# EAGLE design Qwiic GPS - Titan X1 (EAGLE 7.7.0)
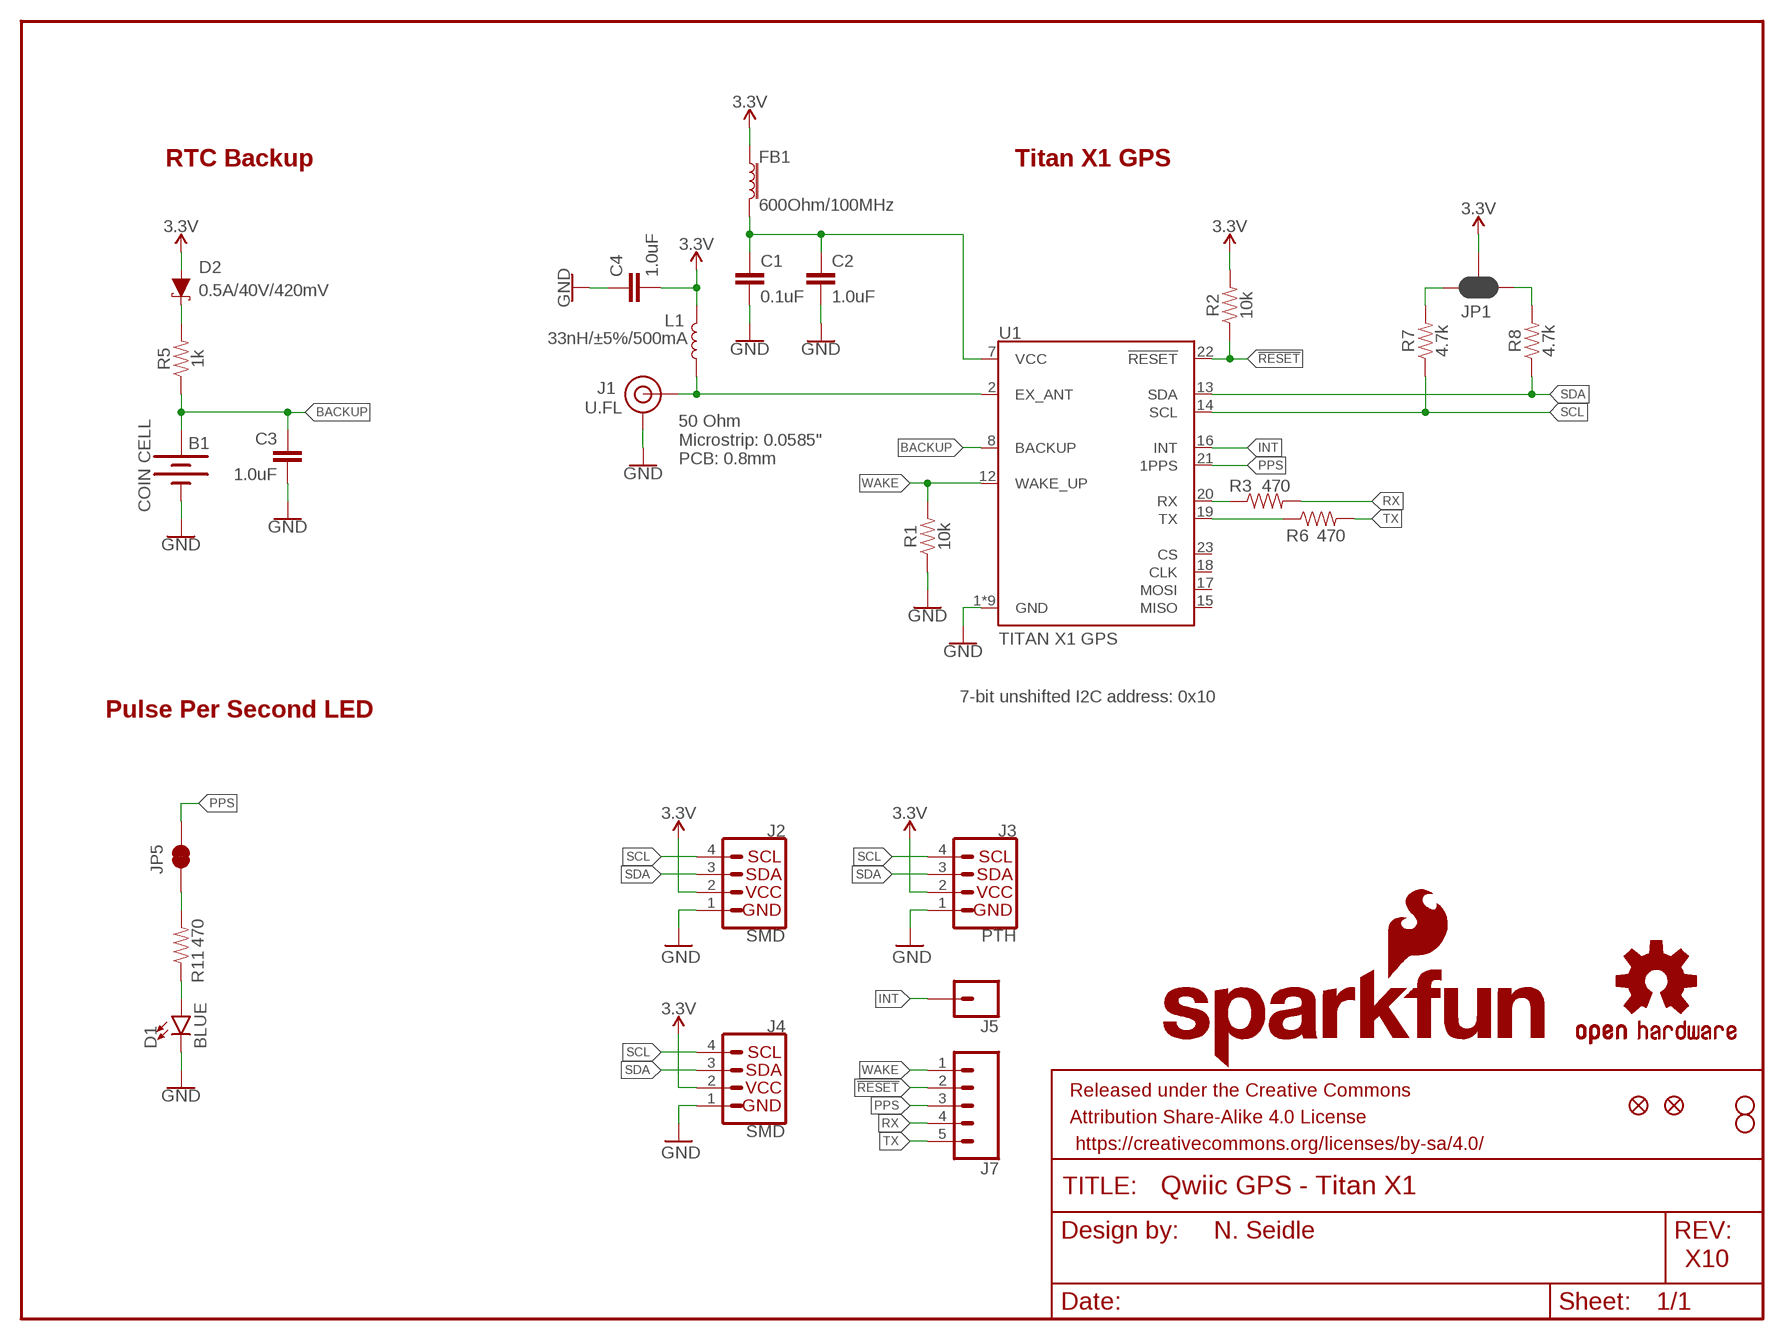
[diagram p0: schematic, sheet 1]

## Parts
B1  COIN CELL  6.8MM_COIN_CELL  [6.8MM_COIN_CELL]
C1  0.1uF  0.1UF-0603-25V-(+80/-20%)  [0603]
C2  1.0uF  1.0UF-0603-16V-10%  [0603]
C3  1.0uF  1.0UF-0603-16V-10%  [0603]
C4  1.0uF  1.0UF-0603-16V-10%  [0603]
D1  BLUE  LED-BLUE0603  [LED-0603]
D2  0.5A/40V/420mV  DIODE-SCHOTTKY-PMEG4005EJ  [SOD-323]
FB1  600Ohm/100MHz  FERRITE_BEAD-0603  [0603]
FRAME1  FRAME-LETTER  [CREATIVE_COMMONS]
J1  U.FL  [U.FL]
J2  SMD  I2C_STANDARDJS-1MM  [1X04_1MM_RA]
J3  PTH  I2C_STANDARD_NO_SILK  [1X04_NO_SILK]
J4  SMD  I2C_STANDARDJS-1MM  [1X04_1MM_RA]
J5  CONN_01PTH_NO_SILK_YES_STOP  [1X01_NO_SILK]
J7  CONN_05NO_SILK  [1X05_NO_SILK]
JP1  JUMPER-SMT_3_2-NC_PASTE_SILK  [SMT-JUMPER_3_2-NC_PASTE_SILK]
JP2  FIDUCIALUFIDUCIAL  [MICRO-FIDUCIAL]
JP3  STAND-OFF  [STAND-OFF]
JP4  STAND-OFF  [STAND-OFF]
JP5  JUMPER-SMT_2_NC_TRACE_NO-SILK  [SMT-JUMPER_2_NC_TRACE_NO-SILK]
JP6  FIDUCIALUFIDUCIAL  [MICRO-FIDUCIAL]
L1  33nH/±5%/500mA  INDUCTOR-0603-33NH  [0603]
LOGO1  OSHW-LOGOMINI  [OSHW-LOGO-MINI]
LOGO2  SFE_LOGO_NAME_FLAME.1_INCH  [SFE_LOGO_NAME_FLAME_.1]
R1  10k  10KOHM-0603-1/10W-1%  [0603]
R2  10k  10KOHM-0603-1/10W-1%  [0603]
R3  470  470OHM-0603-1/10W-1%  [0603]
R5  1k  1KOHM-0603-1/10W-1%  [0603]
R6  470  470OHM-0603-1/10W-1%  [0603]
R7  4.7k  4.7KOHM-0603-1/10W-1%  [0603]
R8  4.7k  4.7KOHM-0603-1/10W-1%  [0603]
R11  470  470OHM-0603-1/10W-1%  [0603]
U1  TITAN X1 GPS  TITAN_X1_GPS  [TITAN_X1_GPS]

## Nets
3.3V: C4.2 D2.A FB1.1 J2.2(VCC) J3.2(VCC) J4.2(VCC) JP1.2 L1.2 R2.2
!RESET: J7.2 R2.1 U1.22(!RESET)
BACKUP: B1.+ C3.1 R5.1 U1.8(BACKUP)
EXT_ANT: J1.FEED(SIGNAL) L1.1 U1.2(EX_ANT)
GND: B1.- C1.2 C2.2 C3.2 C4.1 D1.C J1.1(GND) J1.2(GND) J2.1(GND) J3.1(GND) J4.1(GND) R1.1 U1.1(GND) U1.3(GND) U1.4(GND) U1.5(GND) U1.6(GND) U1.9(GND) U1.10(GND) U1.11(GND) U1.24(GND)
INT: J5.1 U1.16(INT)
N$2: D1.A R11.1
N$4: JP5.1 R11.2
N$5: JP1.1 R8.2
N$6: D2.C R5.2
N$8: JP1.3 R7.2
PPS: J7.3 JP5.2 U1.21(1PPS)
RX: J7.4 R3.2
RXLV: R3.1 U1.20(RX)
SCL: J2.4(SCL) J3.4(SCL) J4.4(SCL) R7.1 U1.14(SCL)
SDA: J2.3(SDA) J3.3(SDA) J4.3(SDA) R8.1 U1.13(SDA)
TX: J7.5 R6.2
TXLV: R6.1 U1.19(TX)
VCC_FILTERED: C1.1 C2.1 FB1.2 U1.7(VCC)
WAKE: J7.1 R1.2 U1.12(WAKE_UP)
Unconnected: U1.15(MISO) U1.17(MOSI) U1.18(CLK) U1.23(CS)

## Notes on the sheet
- RTC Backup | Titan X1 GPS
- 50 Ohm 
  Microstrip: 0.0585"
  PCB: 0.8mm
- 7-bit unshifted I2C address: 0x10
- Pulse Per Second LED
- N. Seidle
- X10

## Library data of the parts
B1 = SparkX:6.8MM_COIN_CELL
C1 = SparkFun-Capacitors:0.1UF: 0.1µF ceramic capacitors A capacitor is a passive two-terminal electrical component used to store electrical energy temporarily in an electric field.; PROD_ID: CAP-00810
C2-C4 = SparkFun-Capacitors:1.0UF: 1µF ceramic capacitors A capacitor is a passive two-terminal electrical component used to store electrical energy temporarily in an electric field.; PROD_ID: CAP-00868
D1 = SparkFun-LED:LED-BLUE: Blue SMD LED Used in manufacturing of various products at SparkFun Packages: 0603 - SMD 0603 package [Product Link] <http://www.digikey.com/product-detail/en/SMLE12BC7TT86/511-1589-2-ND/1641808> 1206 - SMD1206 package [Product Link] <http://www.digikey.com/product-detail/en/lite-on-inc/LTST-C150TBKT/160-1643-1-ND/573584> SparkFun Products: ESP8266 Thing-Dev Board <https://www.sparkfun.com/products/13711> RedBoard <https://www.sparkfun.com/products/12757>; PROD_ID: DIO-08575
D2 = SparkFun-DiscreteSemi:DIODE-SCHOTTKY: Schottky diode A Schottky diode is a semiconductor diode which has a low forward voltage drop and a very fast switching action.; PROD_ID: DIO-10955
FB1 = SparkFun-Coils:FERRITE_BEAD: Ferrite Bead (blocks, cores, rings, chokes, etc.) Inductor with layers of ferrite used to suppress high frequencies. Often used to isolate high frequency noise. SparkFun Products: IOIO-OTG - V2.2 <https://www.sparkfun.com/products/13613> SparkFun SAMD21 Mini Breakout <https://www.sparkfun.com/products/13664> SparkFun 6 Degrees of Freedom Breakout - LSM6DS3 <https://www.sparkfun.com/products/13339> SparkFun SAMD21 Dev Breakout <https://www.sparkfun.com/products/13672>; PROD_ID: NDUC-07859; VALUE: 30Ω/1.8A
FRAME1 = SparkFun-Aesthetics:FRAME-LETTER: Schematic Frame - Letter Standard 8.5x11 US Letter frame
J1 = SparkX:U.FL: SMD Antenna Connector - U.FL 2mm height, 3.0mm x 3.0mm receptacle size. SparkFun Products: SparkFun WiFi Shield - ESP8266 <https://www.sparkfun.com/products/13287> SparkFun ESP8266 Thing <https://www.sparkfun.com/products/13231> SparkFun MiniGen - Pro Mini Signal Generator Shield <https://www.sparkfun.com/products/11420>; PROD_ID: CONN-09193; SF_ID: WRL-09144
J2-J4 = SparkX:I2C_STANDARD: SparkFun I2C Standard Pinout Header SparkFun has standardized on a pinout for all I2C based sensor breakouts. This pinout allows I2C boards to be plugged directly into the headers on Arduino Uno compatible boards, and to be daisy chained easily. Example SparkFun Products: SparkFun Atmospheric Sensor Breakout - BME280 <https://www.sparkfun.com/products/13676> SparkFun Altitude/Pressure Sensor Breakout - MPL3115A2 <https://www.sparkfun.com/products/11084> SparkFun TOF Range Finder Sensor - VL6180 <https://www.sparkfun.com/products/12785>
J5 = SparkFun-Connectors:CONN_01: Single connection point. Often used as Generic Header-pin footprint for 0.1 inch spaced/style header connections On any of the 0.1 inch spaced packages, you can populate with these: Break Away Headers - Straight <https://www.sparkfun.com/products/116> (PRT-00116) Break Away Male Headers - Right Angle <https://www.sparkfun.com/products/553> (PRT-00553) Female Headers <https://www.sparkfun.com/products/115> (PRT-00115) Break Away Headers - Machine Pin <https://www.sparkfun.com/products/117> (PRT-00117) Break Away Female Headers - Swiss Machine Pin <https://www.sparkfun.com/products/743> (PRT-00743) This device is also useful as a general connection point to wire up your design to another part of your project. Our various solder wires solder well into these plated through hole pads. Hook-Up Wire - Assortment (Stranded, 22 AWG) <https://www.sparkfun.com/products/11375> (PRT-11375) Hook-Up Wire - Assortment (Solid Core, 22 AWG) <https://www.sparkfun.com/products/11367> (PRT-11367) View the entire wire category on our website here <https://www.sparkfun.com/categories/141> Special notes: SMTSO-256-ET is a "flush mount" nut for a 4-40 screw. We mostly use this on specialty testbeds; it is a nice way to connect hardware to your PCB at an adjustable hieght. Also note, the SNAP packages are for using a snappable style connector. We sell a baggie of snaps and they are also used on two LilyPad designs: Snap Assortment - 30 pack (male and female) <https://www.sparkfun.com/products/11347> (DEV-11347) LilyPad Arduino SimpleSnap <https://www.sparkfun.com/products/10941> (DEV-10941) LilyPad SimpleSnap Protoboard <https://www.sparkfun.com/products/10940> (DEV-10940)
J7 = SparkFun-Connectors:CONN_05: Multi connection point. Often used as Generic Header-pin footprint for 0.1 inch spaced/style header connections On any of the 0.1 inch spaced packages, you can populate with these: Break Away Headers - Straight <https://www.sparkfun.com/products/116> (PRT-00116) Break Away Male Headers - Right Angle <https://www.sparkfun.com/products/553> (PRT-00553) Female Headers <https://www.sparkfun.com/products/115> (PRT-00115) Break Away Headers - Machine Pin <https://www.sparkfun.com/products/117> (PRT-00117) Break Away Female Headers - Swiss Machine Pin <https://www.sparkfun.com/products/743> (PRT-00743) For SCREWTERMINALS and SPRING TERMINALS visit here: Screw Terimnals on SparkFun.com <https://www.sparkfun.com/search/results?term=Screw+Terminals> (5mm/3.5mm/2.54mm spacing) This device is also useful as a general connection point to wire up your design to another part of your project. Our various solder wires solder well into these plated through hole pads. Hook-Up Wire - Assortment (Stranded, 22 AWG) <https://www.sparkfun.com/products/11375> (PRT-11375) Hook-Up Wire - Assortment (Solid Core, 22 AWG) <https://www.sparkfun.com/products/11367> (PRT-11367) View the entire wire category on our website here <https://www.sparkfun.com/categories/141> Special notes: Molex polarized connector foot print use with SKU : PRT-08231 with associated crimp pins and housings. 1MM SMD Version SKU: PRT-10208
JP1 = SparkFun-Jumpers:JUMPER-SMT_3_2-NC_PASTE: Normally closed solder jumper (2 of 2 connections) This jumper has an aperture in the stencil to allow solder paste to bridge both connections. Both connections are normally closed (NC). Wick off the solder to open the connection(s). Reapply solder to reclose the connection(s).
JP2 JP6 = SparkFun:FIDUCIAL: Fiducial Alignment Points Various fiducial points for machine vision alignment.
JP3 JP4 = SparkFun:STAND-OFF: Stand Off This is the mechanical footprint for a #4 phillips button head screw. Use the keepout ring to avoid running the screw head into surrounding components. SKU : PRT-00447
JP5 = SparkFun-Jumpers:JUMPER-SMT_2_NC_TRACE: Normally closed trace jumper This jumper has a trace between two pads so it's normally closed (NC). Use a razor knife to open the connection. For best results follow the IPC guidelines for cutting traces: Cutout at least 0.063 mm (0.005 in). Remove all loose material to clean up the cut area. Seal the cut with an approved epoxy. Reapply solder to reclose the connection.
L1 = SparkFun-Coils:INDUCTOR: Inductors Resist changes in electrical current. Basically a coil of wire. SparkFun Products: SparkFun Load Cell Amplifier - HX711 <https://www.sparkfun.com/products/13879> IOIO-OTG - V2.2 <https://www.sparkfun.com/products/13613>; PROD_ID: NDUC-07874
LOGO1 = SparkFun-Aesthetics:OSHW-LOGO: Open-Source Hardware (OSHW) Logo This logo indicates the piece of hardware it is found on incorporates a OSHW license and/or adheres to the definition of open source hardware found here: http://freedomdefined.org/OSHW
LOGO2 = SparkFun-Aesthetics:SFE_LOGO_NAME_FLAME: SparkFun Font Logo w/ Flame This is the SparkFun full logo. The logo on the schematic will always be the same size; the package variant is the height of the flame part of the logo. Default layer for the logo on the board is tSilk.
R1 R2 = SparkFun-Resistors:10KOHM: 10kΩ resistor A resistor is a passive two-terminal electrical component that implements electrical resistance as a circuit element. Resistors act to reduce current flow, and, at the same time, act to lower voltage levels within circuits. - Wikipedia; PROD_ID: RES-00824
R3 R6 R11 = SparkFun-Resistors:470OHM: 470Ω resistor A resistor is a passive two-terminal electrical component that implements electrical resistance as a circuit element. Resistors act to reduce current flow, and, at the same time, act to lower voltage levels within circuits. - Wikipedia; PROD_ID: RES-07869
R5 = SparkFun-Resistors:1KOHM: 1kΩ resistor A resistor is a passive two-terminal electrical component that implements electrical resistance as a circuit element. Resistors act to reduce current flow, and, at the same time, act to lower voltage levels within circuits. - Wikipedia; PROD_ID: RES-07856
R7 R8 = SparkFun-Resistors:4.7KOHM: 4.7kΩ resistor A resistor is a passive two-terminal electrical component that implements electrical resistance as a circuit element. Resistors act to reduce current flow, and, at the same time, act to lower voltage levels within circuits. - Wikipedia; PROD_ID: RES-07857
U1 = SparkX:TITAN_X1_GPS

## Board
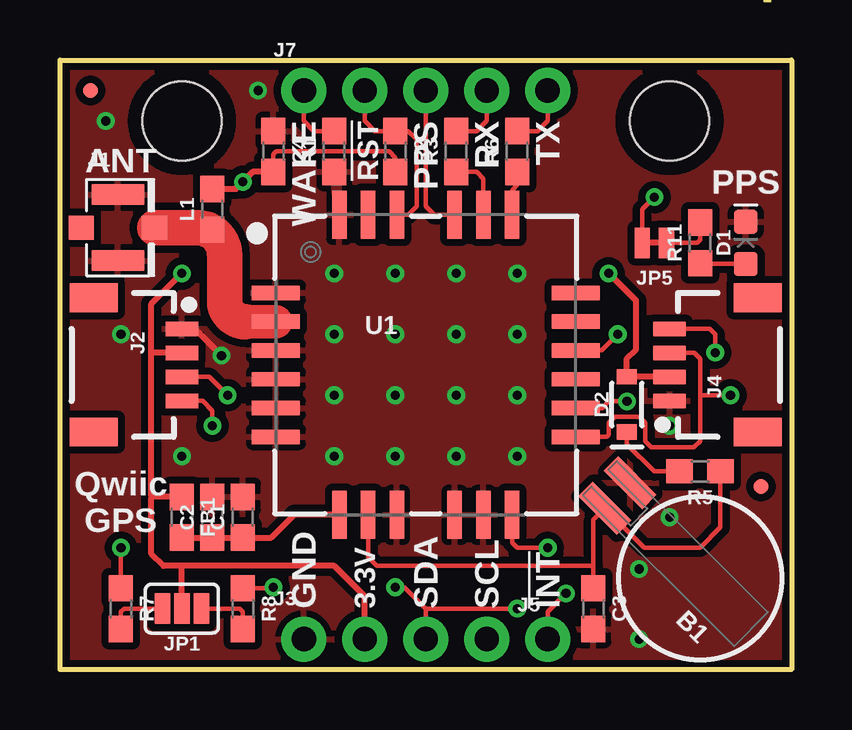
[diagram p1: board, top side]
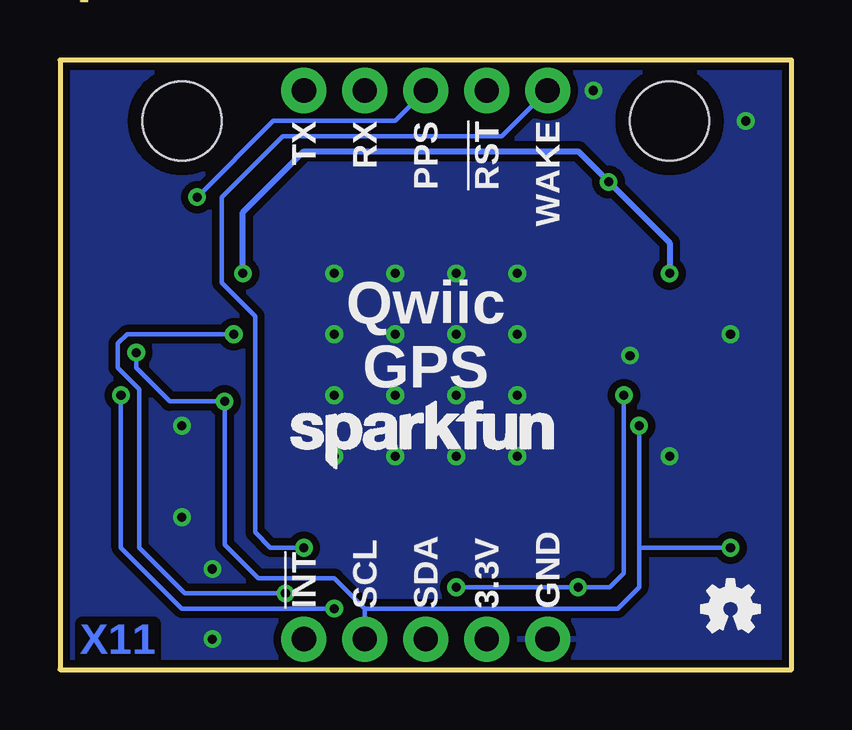
[diagram p2: board, bottom side, seen from below]

Size 30.48 x 25.4 mm. Coordinates in mm from the lower left corner, seen from the top.
Outline: 0,0 0,25.4 30.48,25.4 30.48,0 0,0
Copper layers (1*16): Top 0.035mm / dielectric 1.5mm / Bottom 0.035mm
Design rules "SparkFun-2-layer-TIGHT": minimum track width 7mil, minimum drill 15mil, track to track 7mil, track to pad 7mil, pad to pad 7mil, via to via 7mil, smd to smd 7mil, copper to edge 7mil, drill to drill 7mil, minimum pad ring 7mil, minimum via ring 7mil, stop-mask expansion 4mil, vias tented up to drill 25mil, thermal gap 10mil

### Footprints (pad centres in the part's own frame; a part is rotated, then mirrored left to right if it is on the bottom)
6.8MM_COIN_CELL = smd 2.25 x 0.85: + 4.87,0.75; - 4.87,-0.75
0603 = smd 1.1 x 1: 1 -0.85,0; 2 0.85,0
LED-0603 = smd 1 x 1: A -0.877,0; C 0.877,0
SOD-323 = smd 0.63 x 0.83: A 1.15,0; C -1.15,0
U.FL = smd 2.2 x 0.85: 1 0,1.375; 2 0,-1.375 | smd 1.05 x 1: FEED 1.525,0; NC -1.525,0
1X04_1MM_RA = smd 0.6 x 1.35: 1 -1.5,0; 2 -0.5,0; 3 0.5,0; 4 1.5,0 | smd 1.2 x 2: NC1 2.8,-3.675; NC2 -2.8,-3.675
1X04_NO_SILK = drill 1.016 pad 1.88: 1 0,0; 2 2.54,0; 3 5.08,0; 4 7.62,0
1X01_NO_SILK = drill 1.016 pad 1.88: 1 0,0
1X05_NO_SILK = drill 1.016 pad 1.88: 1 0,0; 2 2.54,0; 3 5.08,0; 4 7.62,0; 5 10.16,0
SMT-JUMPER_3_2-NC_PASTE_SILK = smd 0.635 x 1.27: 1 -0.813,0; 2 0,0; 3 0.813,0
MICRO-FIDUCIAL = smd 0.635 x 0.635: 1 0,0
STAND-OFF = hole 3.302: 0,0
SMT-JUMPER_2_NC_TRACE_NO-SILK = smd 0.635 x 1.27: 1 -0.508,0; 2 0.508,0
TITAN_X1_GPS = smd 2 x 0.6: 1 -6.25,3; 2 -6.25,1.8; 3 -6.25,0.6; 4 -6.25,-0.6; 5 -6.25,-1.8; 6 -6.25,-3; 13 6.25,-3; 14 6.25,-1.8; 15 6.25,-0.6; 16 6.25,0.6; 17 6.25,1.8; 18 6.25,3 | smd 0.6 x 2: 7 -3.6,-6.25; 8 -2.4,-6.25; 9 -1.2,-6.25; 10 1.2,-6.25; 11 2.4,-6.25; 12 3.6,-6.25; 19 3.6,6.25; 20 2.4,6.25; 21 1.2,6.25; 22 -1.2,6.25; 23 -2.4,6.25; 24 -3.6,6.25

### Placement (x,y rotation side)
B1  26.67,3.81 135 top
C1  7.62,6.35 90 top
C2  6.35,6.35 90 top
C3  22.22,2.54 270 top
C4  8.89,21.59 270 top
D1  28.57,17.78 90 top
D2  23.62,11.05 90 top
FB1  5.08,6.35 270 top
FRAME1  -17.78,-17.78 0 top  (outside the outline)
J1  2.41,18.41 0 top
J2  5.08,12.7 270 top
J3  10.16,1.27 0 top
J4  25.4,12.7 90 top
J5  20.32,1.27 0 top
J7  10.16,24.13 0 top
JP1  5.08,2.54 180 top
JP2  29.21,7.62 0 top
JP3  5.08,22.86 0 top
JP4  25.4,22.86 0 top
JP5  24.77,17.78 180 top
JP6  1.27,24.13 0 top
L1  6.35,19.18 90 top
LOGO1  2.54,2.54 0 bottom
LOGO2  -38.1,-24.13 0 top  (outside the outline)
R1  11.43,21.59 90 top
R2  13.97,21.59 270 top
R3  16.51,21.59 90 top
R5  26.67,8.26 180 top
R6  19.05,21.59 90 top
R7  2.54,2.54 270 top
R8  7.62,2.54 270 top
R11  26.67,17.78 90 top
U1  15.24,12.7 0 top
U$1  [SFE_LOGO_NAME_.1]  21.34,7.87 0 bottom

### Tracks (layer width: path | path; a pad name or v marks a point on that pad's centre or on a via)
3.3V  (via drill 0.38)
  Top 0.178: R2.2 13.97,21.34 13.72,21.59 9.02,21.59 8.89,21.46 C4.2
  Top 0.254: 3.81,13.21 3.81,15.24 v5.08,16.51 | L1.2 7.33,20.03 v7.62,20.32 8.04,20.74 C4.2 | J2.2 3.82,13.2 3.81,13.21 | JP1.2 5.08,4.32 | 3.81,13.21 3.81,7.24 3.85,7.2 | FB1.1 3.85,7.2 | J3.2 12.7,3.05 11.43,4.32 5.08,4.32 | 5.08,4.32 4.32,4.32 3.81,4.83 3.81,7.16 3.85,7.2 | v22.86,16.51 24,15.37 24,13.34 23.62,12.95 D2.A J4.2
  Bottom 0.254: v22.86,16.51 22.86,19.05 20.32,21.59 8.89,21.59 v7.62,20.32 5.08,17.78 v5.08,16.51
!RESET
  Top 0.178: J7.2 12.7,22.86 13.12,22.44 R2.1 14.52,22.44 14.86,22.1 14.86,19.3 14.5,18.95 U1.22
BACKUP
  Top 0.178: U1.8 12.84,4.69 13.21,4.32 22.22,4.32 | C3.1 22.22,4.32 | 22.22,4.32 22.22,6.25 B1.+ 24.34,5.08 26.67,5.08 27.52,5.93 R5.1
EXT_ANT
  Top 0.254: L1.1 5.17,18.33 5.08,18.41
  Top 1.397: U1.2 7.72,14.5
  Top 1.486: 7.72,14.5 arc-90 6.86,15.37 6.86,17.27 arc90 5.71,18.41 5.08,18.41 J1.FEED
GND  (via drill 0.38)
  Top 0.254: J2.1 5.61,14.2 v6.73,13.08
  other vias: 11.43,8.89 11.43,11.43 11.43,13.97 11.43,16.51 13.97,16.51 16.51,16.51 19.05,16.51 19.05,13.97 19.05,11.43 19.05,8.89 16.51,8.89 16.51,11.43 16.51,13.97 13.97,13.97 13.97,11.43 13.97,8.89 2.54,13.97 1.91,22.86 8.25,24.13 24.13,1.27 25.4,10.16 25.4,6.35 24.13,4.19 5.08,8.89
  pour Bottom (isolate 0.305): 0,0 0,25.4 30.48,25.4 30.48,0
  pour Top (isolate 0.305): 0,0 0,25.4 30.48,25.4 30.48,0
INT  (via drill 0.38)
  Top 0.178: J5.1 20.32,2.41 v21.08,3.17 | U1.16 22.57,13.3 v23.24,13.97
  Bottom 0.178: v21.08,3.17 25.27,3.17 27.18,5.08 27.18,11.68 28.07,12.57 28.07,13.59 27.69,13.97 v23.24,13.97
N$2
  Top 0.178: D1.A 26.7,16.9 R11.1
N$4
  Top 0.178: JP5.1 26.54,17.78 26.67,17.91 R11.2
N$5
  Top 0.178: JP1.1 7.49,2.54 7.62,2.41 R8.2
N$6
  Top 0.178: R5.2 24.77,8.26 23.62,9.4 D2.C
N$8
  Top 0.178: JP1.3 2.67,2.54 2.54,2.41 R7.2
PPS  (via drill 0.38)
  Top 0.178: U1.21 15.59,18.95 15.24,19.3 J7.3 | JP5.2 24.26,19.18 v24.77,19.68
  Bottom 0.178: v24.77,19.68 21.59,22.86 16.51,22.86 J7.3
RX
  Top 0.178: R3.2 17.36,22.44 17.78,22.86 J7.4
RXLV
  Top 0.178: U1.20 17.64,20.46 17.36,20.74 R3.1
SCL  (via drill 0.38)
  Top 0.178: U1.14 22.58,10.9 22.86,11.18 v23.62,11.18 | J2.4 5.95,11.2 6.35,10.79 v6.35,10.16 | J4.4 27.07,14.2 27.3,13.97 v27.3,13.21 | R7.1 v2.54,5.08
  Bottom 0.178: 17.78,2.54 19.05,3.81 22.22,3.81 23.62,5.21 v23.62,11.18 25.91,11.18 27.3,12.57 v27.3,13.21 | J3.4 17.78,2.54 | v6.35,10.16 6.35,5.08 | 6.35,5.08 6.35,3.43 7.24,2.54 17.78,2.54 | v2.54,5.08 6.35,5.08
SDA  (via drill 0.38)
  Top 0.178: U1.13 22.78,9.7 22.86,9.78 22.86,10.29 23.11,10.54 24.13,10.54 24.38,10.29 24.38,9.53 24.64,9.27 26.42,9.27 26.67,9.53 26.67,11.43 | 15.24,2.54 v19.05,2.54 | J2.3 6.21,12.2 v6.99,11.43 | J3.3 15.24,2.54 | v13.97,3.43 14.35,3.43 15.24,2.54 | v27.94,11.43 26.67,11.43 | J4.3 26.42,13.2 26.67,12.95 26.67,11.43 | R8.1 8.85,3.39 v8.89,3.43
  Bottom 0.178: v19.05,2.54 25.4,2.54 27.94,5.08 v27.94,11.43 | v6.99,11.43 6.99,4.03 7.58,3.43 v8.89,3.43 v13.97,3.43
TX
  Top 0.178: R6.2 19.9,22.44 20.32,22.86 J7.5
TXLV
  Top 0.178: R6.1 19.05,20.19 18.84,19.98 U1.19
VCC_FILTERED
  Top 0.254: FB1.2 C2.1 C1.1 8.8,5.5 9.75,6.45 U1.7
WAKE  (via drill 0.38)
  Top 0.178: R1.2 10.58,22.44 10.16,22.86 J7.1 | U1.12 18.84,5.29 19.05,5.08 v20.32,5.08
  Bottom 0.178: v20.32,5.08 21.72,5.08 22.35,5.71 22.35,14.73 23.75,16.13 23.75,19.68 21.21,22.23 12.07,22.23 J7.1

### Text on the board
Bottom: X11
Dimension: 0.8mm PCB for microstrip
tPlace: WAKE | !RST | PPS | RX | TX | ANT | PPS | Qwiic / GPS | GND | 3.3V | SDA | SCL | !INT
bPlace: WAKE | !RST | PPS | RX | TX | Qwiic / GPS | GND | 3.3V | SDA | SCL | !INT